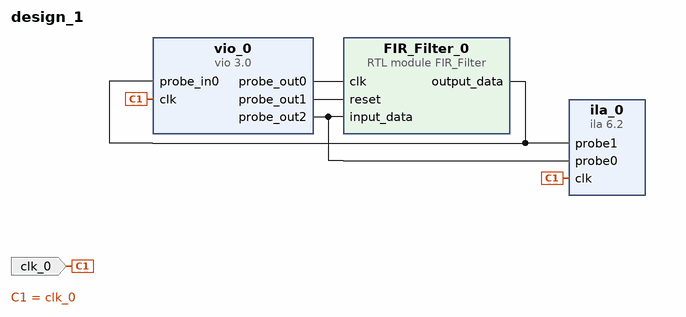
[diagram p0: block diagram of the top level]
# Vivado block design design_1, xc7z010clg400-1, Vivado 2018.1
create_bd_design design_1

create_bd_port -dir I -type clk clk_0

create_bd_cell -type module -reference FIR_Filter FIR_Filter_0
create_bd_cell -type ip -vlnv xilinx.com:ip:vio:3.0 vio_0
set_property -dict {CONFIG.C_PROBE_OUT2_WIDTH 10 CONFIG.C_NUM_PROBE_OUT 3} [get_bd_cells vio_0]
create_bd_cell -type ip -vlnv xilinx.com:ip:ila:6.2 ila_0
set_property -dict [list \
  CONFIG.C_PROBE1_WIDTH 32 \
  CONFIG.C_PROBE0_WIDTH 10 \
  CONFIG.C_NUM_OF_PROBES 2 \
  CONFIG.C_ENABLE_ILA_AXI_MON false \
  CONFIG.C_MONITOR_TYPE Native \
] [get_bd_cells ila_0]

# ---- connections ----

connect_bd_net [get_bd_pins vio_0/probe_out0] [get_bd_pins FIR_Filter_0/clk]
connect_bd_net [get_bd_pins vio_0/probe_out1] [get_bd_pins FIR_Filter_0/reset]
connect_bd_net [get_bd_pins vio_0/probe_out2] [get_bd_pins FIR_Filter_0/input_data] [get_bd_pins ila_0/probe0]
connect_bd_net [get_bd_pins FIR_Filter_0/output_data] [get_bd_pins vio_0/probe_in0] [get_bd_pins ila_0/probe1]
connect_bd_net -net clk_0_1 [get_bd_ports clk_0] [get_bd_pins ila_0/clk] [get_bd_pins vio_0/clk]

validate_bd_design
save_bd_design
